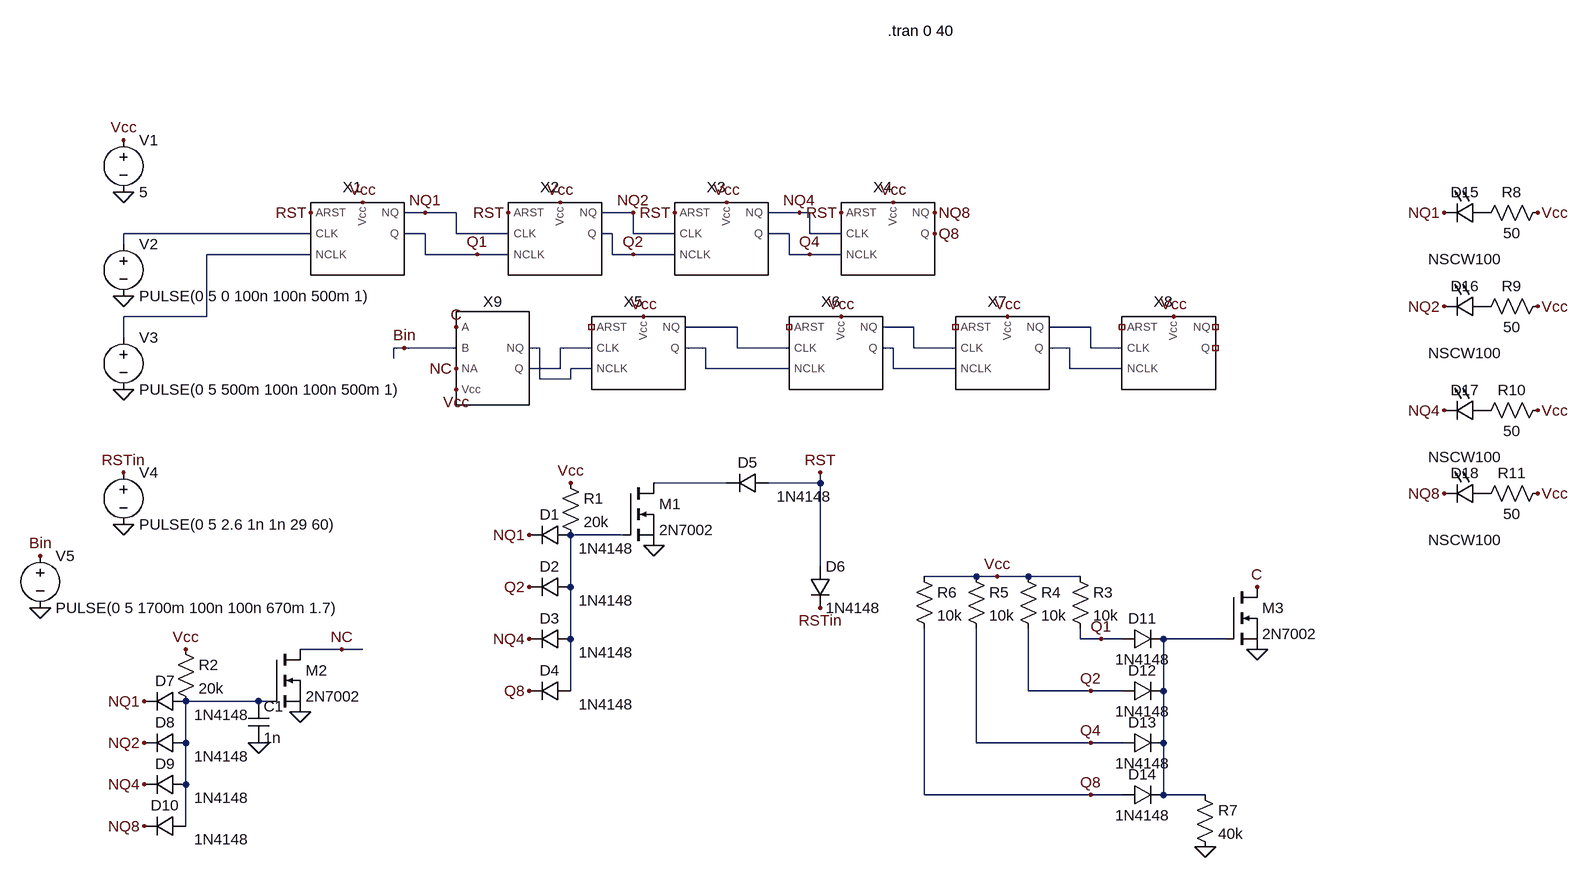
[diagram p0: schematic counter.asc]
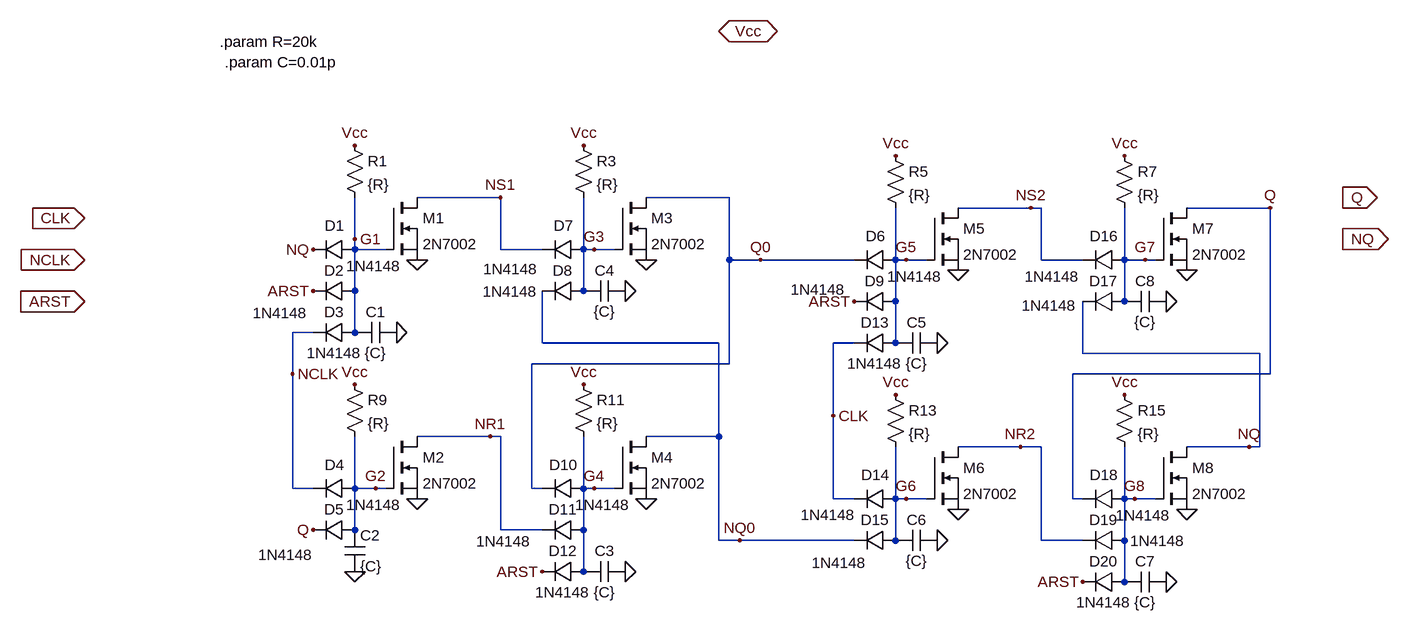
[diagram p1: sub-circuit ff-arst-nmos-diode.asc]
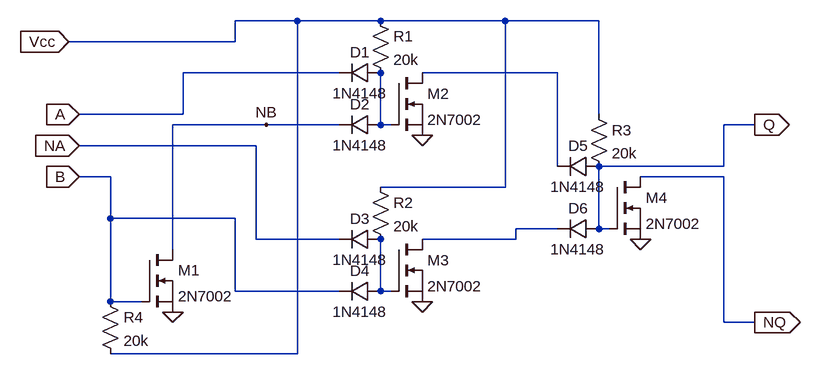
[diagram p2: sub-circuit nxor.asc]
counter.asc, the LTspice schematic file:
Version 4
SHEET 1 1944 1136
WIRE 176 144 144 144
WIRE 224 144 176 144
WIRE 496 144 448 144
WIRE 752 144 704 144
WIRE 768 144 752 144
WIRE 0 176 -288 176
WIRE 176 176 144 176
WIRE 224 176 224 144
WIRE 304 176 224 176
WIRE 464 176 448 176
WIRE 496 176 496 144
WIRE 560 176 496 176
WIRE 736 176 704 176
WIRE 768 176 768 144
WIRE 816 176 768 176
WIRE -288 192 -288 176
WIRE 0 208 -160 208
WIRE 176 208 176 176
WIRE 256 208 176 208
WIRE 304 208 256 208
WIRE 464 208 464 176
WIRE 496 208 464 208
WIRE 560 208 496 208
WIRE 736 208 736 176
WIRE 768 208 736 208
WIRE 816 208 768 208
WIRE -160 304 -160 208
WIRE -160 304 -288 304
WIRE 656 320 576 320
WIRE 928 320 880 320
WIRE 1200 320 1136 320
WIRE -288 336 -288 304
WIRE 144 352 128 352
WIRE 224 352 144 352
WIRE 352 352 336 352
WIRE 432 352 384 352
WIRE 608 352 576 352
WIRE 656 352 656 320
WIRE 736 352 656 352
WIRE 896 352 880 352
WIRE 928 352 928 320
WIRE 992 352 928 352
WIRE 1168 352 1136 352
WIRE 1200 352 1200 320
WIRE 1248 352 1200 352
WIRE 128 368 128 352
WIRE 384 384 384 352
WIRE 384 384 336 384
WIRE 432 384 400 384
WIRE 608 384 608 352
WIRE 736 384 608 384
WIRE 896 384 896 352
WIRE 992 384 896 384
WIRE 1168 384 1168 352
WIRE 1248 384 1168 384
WIRE 352 400 352 352
WIRE 400 400 400 384
WIRE 400 400 352 400
WIRE 640 560 528 560
WIRE 784 560 784 544
WIRE 784 560 704 560
WIRE 480 640 400 640
WIRE 784 688 784 560
WIRE 1024 704 944 704
WIRE 1056 704 1024 704
WIRE 1104 704 1056 704
WIRE 1184 704 1104 704
WIRE 400 720 400 640
WIRE 400 800 400 720
WIRE 1184 800 1184 784
WIRE 1216 800 1184 800
WIRE 1248 800 1216 800
WIRE 1408 800 1312 800
WIRE 48 816 -16 816
WIRE 80 816 48 816
WIRE 400 880 400 800
WIRE 1104 880 1104 784
WIRE 1200 880 1104 880
WIRE 1248 880 1200 880
WIRE 1312 880 1312 800
WIRE -80 896 -192 896
WIRE -64 896 -80 896
WIRE -192 960 -192 896
WIRE 1024 960 1024 784
WIRE 1200 960 1024 960
WIRE 1248 960 1200 960
WIRE 1312 960 1312 880
WIRE -192 1024 -192 960
WIRE 944 1040 944 784
WIRE 1200 1040 944 1040
WIRE 1248 1040 1200 1040
WIRE 1312 1040 1312 960
WIRE 1376 1040 1312 1040
WIRE -192 1088 -192 1024
FLAG -288 112 0
FLAG -288 272 0
FLAG -288 416 0
FLAG 0 144 RST
FLAG 256 208 Q1
FLAG 176 144 NQ1
FLAG -288 32 Vcc
FLAG 80 128 Vcc
FLAG -288 624 0
FLAG 784 544 RST
FLAG 496 144 NQ2
FLAG 752 144 NQ4
FLAG 960 144 NQ8
FLAG 496 208 Q2
FLAG 768 208 Q4
FLAG 960 176 Q8
FLAG 304 144 RST
FLAG 560 144 RST
FLAG 816 144 RST
FLAG 384 128 Vcc
FLAG 640 128 Vcc
FLAG 896 128 Vcc
FLAG 528 656 0
FLAG 400 560 Vcc
FLAG 336 640 NQ1
FLAG 336 720 Q2
FLAG 336 800 NQ4
FLAG 336 880 Q8
FLAG -288 544 RSTin
FLAG 784 752 RSTin
FLAG -192 816 Vcc
FLAG -16 912 0
FLAG -256 896 NQ1
FLAG -256 960 NQ2
FLAG -256 1024 NQ4
FLAG -256 1088 NQ8
FLAG 48 816 NC
FLAG 512 304 Vcc
FLAG 816 304 Vcc
FLAG 1072 304 Vcc
FLAG 1328 304 Vcc
FLAG -80 960 0
FLAG 1456 816 0
FLAG 1376 1120 0
FLAG 1056 704 Vcc
FLAG 1216 800 Q1
FLAG 1200 880 Q2
FLAG 1200 960 Q4
FLAG 1200 1040 Q8
FLAG 1456 720 C
FLAG 1888 144 Vcc
FLAG 1888 288 Vcc
FLAG 1888 448 Vcc
FLAG 1888 576 Vcc
FLAG 1744 144 NQ1
FLAG 1744 288 NQ2
FLAG 1744 448 NQ4
FLAG 1744 576 NQ8
FLAG 224 416 Vcc
FLAG 224 320 C
FLAG 224 384 NC
FLAG -416 752 0
FLAG 144 352 Bin
FLAG -416 672 Bin
SYMBOL ff-arst-nmos-diode 64 176 R0
WINDOW 0 0 -56 Bottom 2
SYMATTR InstName X1
SYMBOL voltage -288 16 R0
SYMATTR InstName V1
SYMATTR Value 5
SYMBOL voltage -288 176 R0
SYMATTR InstName V2
SYMATTR Value PULSE(0 5 0 100n 100n 500m 1)
SYMBOL voltage -288 320 R0
SYMATTR InstName V3
SYMATTR Value PULSE(0 5 500m 100n 100n 500m 1)
SYMBOL voltage -288 528 R0
SYMATTR InstName V4
SYMATTR Value PULSE(0 5 2.6 1n 1n 29 60)
SYMBOL ff-arst-nmos-diode 368 176 R0
WINDOW 0 0 -56 Bottom 2
SYMATTR InstName X2
SYMBOL ff-arst-nmos-diode 624 176 R0
WINDOW 0 0 -56 Bottom 2
SYMATTR InstName X3
SYMBOL ff-arst-nmos-diode 880 176 R0
WINDOW 0 0 -56 Bottom 2
SYMATTR InstName X4
SYMBOL nmos 480 560 R0
SYMATTR InstName M1
SYMATTR Value 2N7002
SYMBOL diode 400 624 R90
WINDOW 0 0 32 VBottom 2
WINDOW 3 21 -55 VTop 2
SYMATTR InstName D1
SYMATTR Value 1N4148
SYMBOL diode 400 704 R90
WINDOW 0 0 32 VBottom 2
WINDOW 3 21 -55 VTop 2
SYMATTR InstName D2
SYMATTR Value 1N4148
SYMBOL diode 400 784 R90
WINDOW 0 0 32 VBottom 2
WINDOW 3 21 -55 VTop 2
SYMATTR InstName D3
SYMATTR Value 1N4148
SYMBOL diode 400 864 R90
WINDOW 0 0 32 VBottom 2
WINDOW 3 21 -55 VTop 2
SYMATTR InstName D4
SYMATTR Value 1N4148
SYMBOL res 384 544 R0
SYMATTR InstName R1
SYMATTR Value 20k
SYMBOL diode 704 544 R90
WINDOW 0 0 32 VBottom 2
WINDOW 3 21 -55 VTop 2
SYMATTR InstName D5
SYMATTR Value 1N4148
SYMBOL diode 768 688 R0
SYMATTR InstName D6
SYMATTR Value 1N4148
SYMBOL diode -192 880 R90
WINDOW 0 0 32 VBottom 2
WINDOW 3 21 -55 VTop 2
SYMATTR InstName D7
SYMATTR Value 1N4148
SYMBOL diode -192 944 R90
WINDOW 0 0 32 VBottom 2
WINDOW 3 21 -55 VTop 2
SYMATTR InstName D8
SYMATTR Value 1N4148
SYMBOL diode -192 1008 R90
WINDOW 0 0 32 VBottom 2
WINDOW 3 21 -55 VTop 2
SYMATTR InstName D9
SYMATTR Value 1N4148
SYMBOL diode -192 1072 R90
WINDOW 0 0 32 VBottom 2
WINDOW 3 21 -55 VTop 2
SYMATTR InstName D10
SYMATTR Value 1N4148
SYMBOL res -208 800 R0
SYMATTR InstName R2
SYMATTR Value 20k
SYMBOL nmos -64 816 R0
SYMATTR InstName M2
SYMATTR Value 2N7002
SYMBOL ff-arst-nmos-diode 496 352 R0
WINDOW 0 0 -56 Bottom 2
SYMATTR InstName X5
SYMBOL ff-arst-nmos-diode 800 352 R0
WINDOW 0 0 -56 Bottom 2
SYMATTR InstName X6
SYMBOL ff-arst-nmos-diode 1056 352 R0
WINDOW 0 0 -56 Bottom 2
SYMATTR InstName X7
SYMBOL ff-arst-nmos-diode 1312 352 R0
WINDOW 0 0 -56 Bottom 2
SYMATTR InstName X8
SYMBOL cap -96 896 R0
SYMATTR InstName C1
SYMATTR Value 1n
SYMBOL nmos 1408 720 R0
SYMATTR InstName M3
SYMATTR Value 2N7002
SYMBOL diode 1248 816 R270
WINDOW 0 32 32 VTop 2
WINDOW 3 0 32 VBottom 2
SYMATTR InstName D11
SYMATTR Value 1N4148
SYMBOL diode 1248 896 R270
WINDOW 0 32 32 VTop 2
WINDOW 3 0 32 VBottom 2
SYMATTR InstName D12
SYMATTR Value 1N4148
SYMBOL diode 1248 976 R270
WINDOW 0 32 32 VTop 2
WINDOW 3 0 32 VBottom 2
SYMATTR InstName D13
SYMATTR Value 1N4148
SYMBOL diode 1248 1056 R270
WINDOW 0 32 32 VTop 2
WINDOW 3 0 32 VBottom 2
SYMATTR InstName D14
SYMATTR Value 1N4148
SYMBOL res 1168 688 R0
SYMATTR InstName R3
SYMATTR Value 10k
SYMBOL res 1088 688 R0
SYMATTR InstName R4
SYMATTR Value 10k
SYMBOL res 1008 688 R0
SYMATTR InstName R5
SYMATTR Value 10k
SYMBOL res 928 688 R0
SYMATTR InstName R6
SYMATTR Value 10k
SYMBOL res 1360 1024 R0
SYMATTR InstName R7
SYMATTR Value 40k
SYMBOL LED 1808 128 R90
WINDOW 0 0 32 VBottom 2
WINDOW 3 72 32 VTop 2
SYMATTR InstName D15
SYMATTR Value NSCW100
SYMBOL res 1904 128 R90
WINDOW 0 0 56 VBottom 2
WINDOW 3 32 56 VTop 2
SYMATTR InstName R8
SYMATTR Value 50
SYMBOL LED 1808 272 R90
WINDOW 0 0 32 VBottom 2
WINDOW 3 72 32 VTop 2
SYMATTR InstName D16
SYMATTR Value NSCW100
SYMBOL res 1904 272 R90
WINDOW 0 0 56 VBottom 2
WINDOW 3 32 56 VTop 2
SYMATTR InstName R9
SYMATTR Value 50
SYMBOL LED 1808 432 R90
WINDOW 0 0 32 VBottom 2
WINDOW 3 72 32 VTop 2
SYMATTR InstName D17
SYMATTR Value NSCW100
SYMBOL res 1904 432 R90
WINDOW 0 0 56 VBottom 2
WINDOW 3 32 56 VTop 2
SYMATTR InstName R10
SYMATTR Value 50
SYMBOL LED 1808 560 R90
WINDOW 0 0 32 VBottom 2
WINDOW 3 72 32 VTop 2
SYMATTR InstName D18
SYMATTR Value NSCW100
SYMBOL res 1904 560 R90
WINDOW 0 0 56 VBottom 2
WINDOW 3 32 56 VTop 2
SYMATTR InstName R11
SYMATTR Value 50
SYMBOL nxor 272 368 R0
SYMATTR InstName X9
SYMBOL voltage -416 656 R0
SYMATTR InstName V5
SYMATTR Value PULSE(0 5 1700m 100n 100n 670m 1.7)
TEXT 888 -136 Left 2 !.tran 0 40

ff-arst-nmos-diode.asc, the sub-circuit schematic file:
Version 4
SHEET 1 1760 800
WIRE 400 160 272 160
WIRE 752 160 624 160
WIRE 1216 176 1104 176
WIRE 1232 176 1216 176
WIRE 1584 176 1456 176
WIRE 176 224 176 160
WIRE 176 240 176 224
WIRE 224 240 176 240
WIRE 400 240 400 160
WIRE 464 240 400 240
WIRE 528 240 528 160
WIRE 544 240 528 240
WIRE 576 240 544 240
WIRE 752 256 752 160
WIRE 800 256 752 256
WIRE 944 256 800 256
WIRE 1008 256 1008 176
WIRE 1024 256 1008 256
WIRE 1056 256 1024 256
WIRE 1232 256 1232 176
WIRE 1296 256 1232 256
WIRE 1360 256 1360 176
WIRE 1392 256 1360 256
WIRE 1408 256 1392 256
WIRE 176 304 176 240
WIRE 528 304 528 240
WIRE 1008 320 1008 256
WIRE 1360 320 1360 256
WIRE 112 368 80 368
WIRE 176 368 176 304
WIRE 464 384 464 304
WIRE 736 384 464 384
WIRE 944 384 912 384
WIRE 1008 384 1008 320
WIRE 1296 400 1296 320
WIRE 1568 400 1296 400
WIRE 752 416 752 256
WIRE 752 416 448 416
WIRE 80 432 80 368
WIRE 1584 432 1584 176
WIRE 1584 432 1280 432
WIRE 912 496 912 384
WIRE 384 528 272 528
WIRE 400 528 384 528
WIRE 736 528 736 384
WIRE 736 528 624 528
WIRE 1200 544 1104 544
WIRE 1232 544 1200 544
WIRE 1552 544 1456 544
WIRE 1568 544 1568 400
WIRE 1568 544 1552 544
WIRE 80 608 80 432
WIRE 112 608 80 608
WIRE 176 608 176 528
WIRE 208 608 176 608
WIRE 224 608 208 608
WIRE 448 608 448 416
WIRE 464 608 448 608
WIRE 528 608 528 528
WIRE 544 608 528 608
WIRE 576 608 544 608
WIRE 912 624 912 496
WIRE 944 624 912 624
WIRE 1008 624 1008 544
WIRE 1024 624 1008 624
WIRE 1056 624 1024 624
WIRE 1280 624 1280 432
WIRE 1296 624 1280 624
WIRE 1360 624 1360 544
WIRE 1376 624 1360 624
WIRE 1408 624 1376 624
WIRE 176 672 176 608
WIRE 400 672 400 528
WIRE 464 672 400 672
WIRE 528 672 528 608
WIRE 736 688 736 528
WIRE 768 688 736 688
WIRE 944 688 768 688
WIRE 1008 688 1008 624
WIRE 1232 688 1232 544
WIRE 1296 688 1232 688
WIRE 1360 688 1360 624
WIRE 528 736 528 672
WIRE 1360 752 1360 688
FLAG 272 256 0
FLAG 272 624 0
FLAG 624 256 0
FLAG 624 624 0
FLAG 80 432 NCLK
FLAG 112 304 ARST
FLAG 464 736 ARST
FLAG 1104 272 0
FLAG 1104 640 0
FLAG 1456 272 0
FLAG 1456 640 0
FLAG 944 320 ARST
FLAG 1296 752 ARST
FLAG 912 496 CLK
FLAG 1584 176 Q
FLAG 112 240 NQ
FLAG 112 672 Q
FLAG -240 192 CLK
IOPIN -240 192 In
FLAG -240 256 NCLK
IOPIN -240 256 In
FLAG -240 320 ARST
IOPIN -240 320 In
FLAG 1696 160 Q
IOPIN 1696 160 Out
FLAG 1696 224 NQ
IOPIN 1696 224 Out
FLAG 176 80 Vcc
FLAG 528 80 Vcc
FLAG 1008 96 Vcc
FLAG 1360 96 Vcc
FLAG 1360 464 Vcc
FLAG 1008 464 Vcc
FLAG 528 448 Vcc
FLAG 176 448 Vcc
FLAG 736 -96 Vcc
IOPIN 736 -96 BiDir
FLAG 1552 544 NQ
FLAG 176 224 G1
FLAG 208 608 G2
FLAG 544 240 G3
FLAG 544 608 G4
FLAG 1024 256 G5
FLAG 1024 624 G6
FLAG 1392 256 G7
FLAG 1376 624 G8
FLAG 400 160 NS1
FLAG 384 528 NR1
FLAG 1216 176 NS2
FLAG 1200 544 NR2
FLAG 800 256 Q0
FLAG 768 688 NQ0
FLAG 240 368 0
FLAG 592 304 0
FLAG 592 736 0
FLAG 1072 688 0
FLAG 1072 384 0
FLAG 1424 320 0
FLAG 1424 752 0
FLAG 176 736 0
SYMBOL nmos 224 160 R0
SYMATTR InstName M1
SYMATTR Value 2N7002
SYMBOL diode 176 224 R90
WINDOW 0 -5 31 VBottom 2
WINDOW 3 26 -29 VTop 2
SYMATTR InstName D1
SYMATTR Value 1N4148
SYMBOL diode 176 288 R90
WINDOW 0 0 32 VBottom 2
WINDOW 3 34 115 VTop 2
SYMATTR InstName D2
SYMATTR Value 1N4148
SYMBOL diode 176 352 R90
WINDOW 0 0 32 VBottom 2
WINDOW 3 32 32 VTop 2
SYMATTR InstName D3
SYMATTR Value 1N4148
SYMBOL nmos 224 528 R0
SYMATTR InstName M2
SYMATTR Value 2N7002
SYMBOL diode 176 592 R90
WINDOW 0 -5 31 VBottom 2
WINDOW 3 26 -29 VTop 2
SYMATTR InstName D4
SYMATTR Value 1N4148
SYMBOL diode 176 656 R90
WINDOW 0 0 32 VBottom 2
WINDOW 3 39 106 VTop 2
SYMATTR InstName D5
SYMATTR Value 1N4148
SYMBOL nmos 576 160 R0
SYMATTR InstName M3
SYMATTR Value 2N7002
SYMBOL diode 528 224 R90
WINDOW 0 -5 31 VBottom 2
WINDOW 3 31 112 VTop 2
SYMATTR InstName D7
SYMATTR Value 1N4148
SYMBOL diode 528 288 R90
WINDOW 0 0 32 VBottom 2
WINDOW 3 1 113 VTop 2
SYMATTR InstName D8
SYMATTR Value 1N4148
SYMBOL nmos 576 528 R0
SYMATTR InstName M4
SYMATTR Value 2N7002
SYMBOL diode 528 592 R90
WINDOW 0 -5 31 VBottom 2
WINDOW 3 26 -29 VTop 2
SYMATTR InstName D10
SYMATTR Value 1N4148
SYMBOL diode 528 656 R90
WINDOW 0 0 32 VBottom 2
WINDOW 3 18 123 VTop 2
SYMATTR InstName D11
SYMATTR Value 1N4148
SYMBOL diode 528 720 R90
WINDOW 0 0 32 VBottom 2
WINDOW 3 32 32 VTop 2
SYMATTR InstName D12
SYMATTR Value 1N4148
SYMBOL nmos 1056 176 R0
SYMATTR InstName M5
SYMATTR Value 2N7002
SYMBOL diode 1008 240 R90
WINDOW 0 -5 31 VBottom 2
WINDOW 3 26 -29 VTop 2
SYMATTR InstName D6
SYMATTR Value 1N4148
SYMBOL diode 1008 304 R90
WINDOW 0 0 32 VBottom 2
WINDOW 3 -18 119 VTop 2
SYMATTR InstName D9
SYMATTR Value 1N4148
SYMBOL diode 1008 368 R90
WINDOW 0 0 32 VBottom 2
WINDOW 3 32 32 VTop 2
SYMATTR InstName D13
SYMATTR Value 1N4148
SYMBOL nmos 1056 544 R0
SYMATTR InstName M6
SYMATTR Value 2N7002
SYMBOL diode 1008 608 R90
WINDOW 0 -5 31 VBottom 2
WINDOW 3 99 87 VTop 2
SYMATTR InstName D14
SYMATTR Value 1N4148
SYMBOL diode 1008 672 R90
WINDOW 0 0 32 VBottom 2
WINDOW 3 -39 104 VTop 2
SYMATTR InstName D15
SYMATTR Value 1N4148
SYMBOL nmos 1408 176 R0
SYMATTR InstName M7
SYMATTR Value 2N7002
SYMBOL diode 1360 240 R90
WINDOW 0 -5 31 VBottom 2
WINDOW 3 26 111 VTop 2
SYMATTR InstName D16
SYMATTR Value 1N4148
SYMBOL diode 1360 304 R90
WINDOW 0 0 32 VBottom 2
WINDOW 3 7 116 VTop 2
SYMATTR InstName D17
SYMATTR Value 1N4148
SYMBOL nmos 1408 544 R0
SYMATTR InstName M8
SYMATTR Value 2N7002
SYMBOL diode 1360 608 R90
WINDOW 0 -5 31 VBottom 2
WINDOW 3 26 -29 VTop 2
SYMATTR InstName D18
SYMATTR Value 1N4148
SYMBOL diode 1360 672 R90
WINDOW 0 0 32 VBottom 2
WINDOW 3 1 -51 VTop 2
SYMATTR InstName D19
SYMATTR Value 1N4148
SYMBOL diode 1360 736 R90
WINDOW 0 0 32 VBottom 2
WINDOW 3 32 32 VTop 2
SYMATTR InstName D20
SYMATTR Value 1N4148
SYMBOL res 160 64 R0
SYMATTR InstName R1
SYMATTR Value {R}
SYMBOL res 512 64 R0
SYMATTR InstName R3
SYMATTR Value {R}
SYMBOL res 992 80 R0
SYMATTR InstName R5
SYMATTR Value {R}
SYMBOL res 1344 80 R0
SYMATTR InstName R7
SYMATTR Value {R}
SYMBOL res 160 432 R0
SYMATTR InstName R9
SYMATTR Value {R}
SYMBOL res 512 432 R0
SYMATTR InstName R11
SYMATTR Value {R}
SYMBOL res 992 448 R0
SYMATTR InstName R13
SYMATTR Value {R}
SYMBOL res 1344 448 R0
SYMATTR InstName R15
SYMATTR Value {R}
SYMBOL cap 240 352 R90
WINDOW 0 0 32 VBottom 2
WINDOW 3 32 32 VTop 2
SYMATTR InstName C1
SYMATTR Value {C}
SYMBOL cap 160 672 R0
SYMATTR InstName C2
SYMATTR Value {C}
SYMBOL cap 592 720 R90
WINDOW 0 0 32 VBottom 2
WINDOW 3 32 32 VTop 2
SYMATTR InstName C3
SYMATTR Value {C}
SYMBOL cap 592 288 R90
WINDOW 0 0 32 VBottom 2
WINDOW 3 32 32 VTop 2
SYMATTR InstName C4
SYMATTR Value {C}
SYMBOL cap 1072 368 R90
WINDOW 0 0 32 VBottom 2
WINDOW 3 32 32 VTop 2
SYMATTR InstName C5
SYMATTR Value {C}
SYMBOL cap 1072 672 R90
WINDOW 0 0 32 VBottom 2
WINDOW 3 32 32 VTop 2
SYMATTR InstName C6
SYMATTR Value {C}
SYMBOL cap 1424 736 R90
WINDOW 0 0 32 VBottom 2
WINDOW 3 32 32 VTop 2
SYMATTR InstName C7
SYMATTR Value {C}
SYMBOL cap 1424 304 R90
WINDOW 0 0 32 VBottom 2
WINDOW 3 32 32 VTop 2
SYMATTR InstName C8
SYMATTR Value {C}
TEXT -32 -80 Left 2 !.param R=20k
TEXT -24 -48 Left 2 !.param C=0.01p

nxor.asc, the sub-circuit schematic file:
Version 4
SHEET 1 880 680
WIRE -64 48 -160 48
WIRE 64 48 -64 48
WIRE 256 48 64 48
WIRE 400 48 256 48
WIRE -160 80 -160 48
WIRE -160 80 -416 80
WIRE 0 128 -240 128
WIRE 336 128 128 128
WIRE -240 192 -240 128
WIRE -240 192 -400 192
WIRE 400 192 400 48
WIRE -112 208 -256 208
WIRE 0 208 -112 208
WIRE 64 208 64 128
WIRE 80 208 64 208
WIRE 640 208 592 208
WIRE -128 240 -400 240
WIRE 336 272 336 128
WIRE 592 272 592 208
WIRE 592 272 400 272
WIRE -352 288 -400 288
WIRE 592 288 464 288
WIRE 256 304 256 48
WIRE 256 304 64 304
WIRE -352 352 -352 288
WIRE -160 352 -352 352
WIRE 336 368 272 368
WIRE 400 368 400 272
WIRE 416 368 400 368
WIRE -128 384 -128 240
WIRE 0 384 -128 384
WIRE 272 384 272 368
WIRE 272 384 128 384
WIRE -256 400 -256 208
WIRE -160 464 -160 352
WIRE 0 464 -160 464
WIRE 64 464 64 384
WIRE 80 464 64 464
WIRE -352 480 -352 352
WIRE -304 480 -352 480
WIRE 592 512 592 288
WIRE 640 512 592 512
WIRE -64 560 -64 48
WIRE -64 560 -352 560
FLAG -400 192 A
IOPIN -400 192 In
FLAG -400 240 NA
IOPIN -400 240 In
FLAG -400 288 B
IOPIN -400 288 In
FLAG 640 208 Q
IOPIN 640 208 Out
FLAG 640 512 NQ
IOPIN 640 512 Out
FLAG -256 496 0
FLAG -416 80 Vcc
IOPIN -416 80 In
FLAG 128 480 0
FLAG 128 224 0
FLAG 464 384 0
FLAG -112 208 NB
SYMBOL diode 64 112 R90
WINDOW 0 0 32 VBottom 2
WINDOW 3 32 32 VTop 2
SYMATTR InstName D1
SYMATTR Value 1N4148
SYMBOL nmos -304 400 R0
SYMATTR InstName M1
SYMATTR Value 2N7002
SYMBOL diode 64 192 R90
WINDOW 0 0 32 VBottom 2
WINDOW 3 32 32 VTop 2
SYMATTR InstName D2
SYMATTR Value 1N4148
SYMBOL diode 64 368 R90
WINDOW 0 0 32 VBottom 2
WINDOW 3 32 32 VTop 2
SYMATTR InstName D3
SYMATTR Value 1N4148
SYMBOL diode 64 448 R90
WINDOW 0 0 32 VBottom 2
WINDOW 3 32 32 VTop 2
SYMATTR InstName D4
SYMATTR Value 1N4148
SYMBOL diode 400 256 R90
WINDOW 0 0 32 VBottom 2
WINDOW 3 32 32 VTop 2
SYMATTR InstName D5
SYMATTR Value 1N4148
SYMBOL diode 400 352 R90
WINDOW 0 0 32 VBottom 2
WINDOW 3 32 32 VTop 2
SYMATTR InstName D6
SYMATTR Value 1N4148
SYMBOL nmos 80 128 R0
SYMATTR InstName M2
SYMATTR Value 2N7002
SYMBOL nmos 80 384 R0
SYMATTR InstName M3
SYMATTR Value 2N7002
SYMBOL nmos 416 288 R0
SYMATTR InstName M4
SYMATTR Value 2N7002
SYMBOL res 48 32 R0
SYMATTR InstName R1
SYMATTR Value 20k
SYMBOL res 48 288 R0
SYMATTR InstName R2
SYMATTR Value 20k
SYMBOL res 384 176 R0
SYMATTR InstName R3
SYMATTR Value 20k
SYMBOL res -368 464 R0
SYMATTR InstName R4
SYMATTR Value 20k

The netlist it stands for:
* counter.asc
XX1 RST N001 N002 NQ1 Q1 Vcc ff-arst-nmos-diode
V1 Vcc 0 5
V2 N001 0 PULSE(0 5 0 100n 100n 500m 1)
V3 N002 0 PULSE(0 5 500m 100n 100n 500m 1)
V4 RSTin 0 PULSE(0 5 2.6 1n 1n 29 60)
XX2 RST NQ1 Q1 NQ2 Q2 Vcc ff-arst-nmos-diode
XX3 RST NQ2 Q2 NQ4 Q4 Vcc ff-arst-nmos-diode
XX4 RST NQ4 Q4 NQ8 Q8 Vcc ff-arst-nmos-diode
M1 N011 N012 0 0 2N7002
D1 N012 NQ1 1N4148
D2 N012 Q2 1N4148
D3 N012 NQ4 1N4148
D4 N012 Q8 1N4148
R1 Vcc N012 20k
D5 RST N011 1N4148
D6 RST RSTin 1N4148
D7 N014 NQ1 1N4148
D8 N014 NQ2 1N4148
D9 N014 NQ4 1N4148
D10 N014 NQ8 1N4148
R2 Vcc N014 20k
M2 NC N014 0 0 2N7002
XX5 NC_01 N007 N006 N003 N008 Vcc ff-arst-nmos-diode
XX6 NC_02 N003 N008 N004 N009 Vcc ff-arst-nmos-diode
XX7 NC_03 N004 N009 N005 N010 Vcc ff-arst-nmos-diode
XX8 NC_04 N005 N010 NC_05 NC_06 Vcc ff-arst-nmos-diode
C1 N014 0 1n
M3 C N013 0 0 2N7002
D11 Q1 N013 1N4148
D12 Q2 N013 1N4148
D13 Q4 N013 1N4148
D14 Q8 N013 1N4148
R3 Vcc Q1 10k
R4 Vcc Q2 10k
R5 Vcc Q4 10k
R6 Vcc Q8 10k
R7 N013 0 40k
D15 P001 NQ1 NSCW100
R8 Vcc P001 50
D16 P002 NQ2 NSCW100
R9 Vcc P002 50
D17 P003 NQ4 NSCW100
R10 Vcc P003 50
D18 P004 NQ8 NSCW100
R11 Vcc P004 50
XX9 C Bin NC Vcc N006 N007 nxor
V5 Bin 0 PULSE(0 5 1700m 100n 100n 670m 1.7)

* block symbol definitions
.subckt ff-arst-nmos-diode ARST CLK NCLK NQ Q Vcc
M1 NS1 G1 0 0 2N7002
D1 G1 NQ 1N4148
D2 G1 ARST 1N4148
D3 G1 NCLK 1N4148
M2 NR1 G2 0 0 2N7002
D4 G2 NCLK 1N4148
D5 G2 Q 1N4148
M3 Q0 G3 0 0 2N7002
D7 G3 NS1 1N4148
D8 G3 NQ0 1N4148
M4 NQ0 G4 0 0 2N7002
D10 G4 Q0 1N4148
D11 G4 NR1 1N4148
D12 G4 ARST 1N4148
M5 NS2 G5 0 0 2N7002
D6 G5 Q0 1N4148
D9 G5 ARST 1N4148
D13 G5 CLK 1N4148
M6 NR2 G6 0 0 2N7002
D14 G6 CLK 1N4148
D15 G6 NQ0 1N4148
M7 Q G7 0 0 2N7002
D16 G7 NS2 1N4148
D17 G7 NQ 1N4148
M8 NQ G8 0 0 2N7002
D18 G8 Q 1N4148
D19 G8 NR2 1N4148
D20 G8 ARST 1N4148
R1 Vcc G1 {R}
R3 Vcc G3 {R}
R5 Vcc G5 {R}
R7 Vcc G7 {R}
R9 Vcc G2 {R}
R11 Vcc G4 {R}
R13 Vcc G6 {R}
R15 Vcc G8 {R}
C1 0 G1 {C}
C2 G2 0 {C}
C3 0 G4 {C}
C4 0 G3 {C}
C5 0 G5 {C}
C6 0 G6 {C}
C7 0 G8 {C}
C8 0 G7 {C}
.param R=20k
.param C=0.01p
.ends ff-arst-nmos-diode

.subckt nxor A B NA Vcc NQ Q
D1 N002 A 1N4148
M1 NB B 0 0 2N7002
D2 N002 NB 1N4148
D3 N004 NA 1N4148
D4 N004 B 1N4148
D5 Q N001 1N4148
D6 Q N003 1N4148
M2 N001 N002 0 0 2N7002
M3 N003 N004 0 0 2N7002
M4 NQ Q 0 0 2N7002
R1 Vcc N002 20k
R2 Vcc N004 20k
R3 Vcc Q 20k
R4 B Vcc 20k
.ends nxor

.model D D
.lib standard.dio
.model NMOS NMOS
.model PMOS PMOS
.lib standard.mos
.tran 0 40
.backanno
.end